# Altium project Reg_Thermique_Resist.PrjPcb
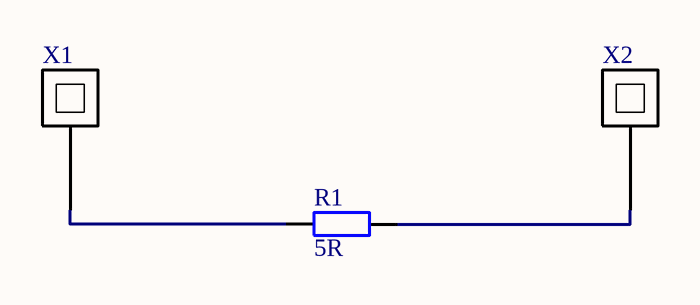
[diagram p0: Power_Resistor.SchDoc]
1 sheet, 3 parts. Net scope: global (net labels, ports and power ports of the same name join across sheets).
Board file: Reg_therm_Res.PcbDoc

## Sheet Power_Resistor.SchDoc
size A3; Organization: ETML-ES; Address1: Avenue Recordon 1; Address2: 1004 Lausanne; Address3: Switzerland; SheetNumber: 1; SheetTotal: 1

### Parts
R1  5R  [AXIAL-0.9]
X1  3V3  [PIN1]  (value not drawn)
X2  3V3  [PIN1]  (value not drawn)

### Nets
NetR1_1: R1.1 X2.1
NetR1_2: R1.2 X1.1

### Notes on the sheet
- Fichier :
- a
- Date :
- Heure :
- Version :
- Auteur :
- Modif.
- b
- c
- d
- Projet :
- No :
- Nb feuilles
- Feuille n°
- Chemin :

### Library data of the parts
R1 = CMP-2001-00528-1: Res 270R; Part Number: ERJ6ENF2703V; Manufacturer: Panasonic
X1 X2 = Berg: CONN HEADER VERT 1POS; Supplier: Stock ES